# Altium schematic sheet RGBW_controller.SchDoc
size A4; DrawnBy: Sergey Starovoitov; Revision: A; SheetNumber: 1; SheetTotal: 1
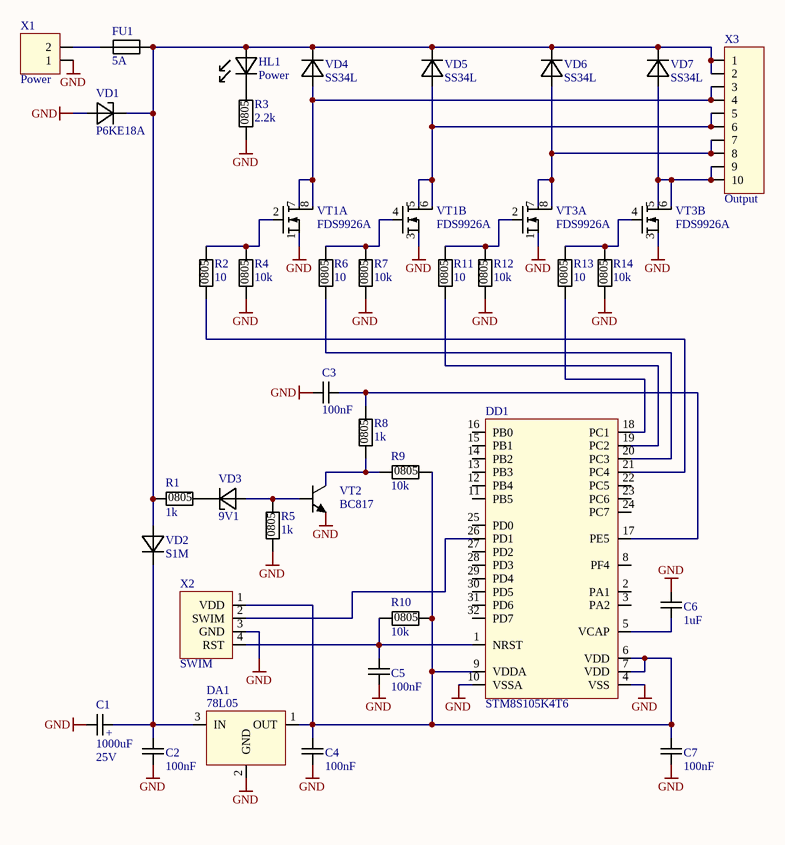
[diagram p0: RGBW_controller.SchDoc]

## Parts
C1  1000uF  Voltage: 25V  [CapEl 10x20x5 axial]
C2  100nF  [C0805]
C3  100nF  [C0805]
C4  100nF  [C0805]
C5  100nF  [C0805]
C6  1uF  [C0805]
C7  100nF  [C0805]
DA1  78L05  [TO92 line]
DD1  STM8S105K4T6  [TQFP32]
FU1  5A  [Fuse 4x10]
HL1  Power  [LED 3mm green]
R1  1k  [R0805]
R2  10  [R0805]
R3  2.2k  [R0805]
R4  10k  [R0805]
R5  1k  [R0805]
R6  10  [R0805]
R7  10k  [R0805]
R8  1k  [R0805]
R9  10k  [R0805]
R10  10k  [R0805]
R11  10  [R0805]
R12  10k  [R0805]
R13  10  [R0805]
R14  10k  [R0805]
VD1  P6KE18A  [DO15]
VD2  S1M  [SMA]
VD3  9V1  [SOD80]
VD4  SS34L  [SMA]
VD5  SS34L  [SMA]
VD6  SS34L  [SMA]
VD7  SS34L  [SMA]
VT1  FDS9926A  [SO8]  (parts A,B of 2)
VT2  BC817  [SOT23-3]
VT3  FDS9926A  [SO8]  (parts A,B of 2)
X1  Power  [DG301-5,0-2P]
X2  SWIM  [PLS4]
X3  Output  [DG380-3,81-10P]

## Nets
GND: C1.2 C2.2 C3.2 C4.2 C5.1 C6.2 C7.1 DA1.2(GND) DD1.4(VSS) DD1.10(VSSA) R3.1 R4.1 R5.1 R7.1 R12.1 R14.1 VD1.1(A) VT1.1(S) VT1.3(S) VT2.2(E) VT3.1(S) VT3.3(S) X1.1 X2.3(GND)
NetC1_1: C1.1 C2.1 DA1.3(IN) VD2.2(K)
NetC3_1: C3.1 DD1.17(PE5) R8.2
NetC4_1: C4.1 C7.2 DA1.1(OUT) DD1.6(VDD) DD1.7(VDD) DD1.9(VDDA) R9.2 R10.2 X2.1(VDD)
NetC5_2: C5.2 DD1.1(NRST) R10.1 X2.4(RST)
NetC6_1: C6.1 DD1.5(VCAP)
NetDD1_18: DD1.18(PC1) R13.1
NetDD1_19: DD1.19(PC2) R11.1
NetDD1_20: DD1.20(PC3) R6.1
NetDD1_21: DD1.21(PC4) R2.1
NetDD1_26: DD1.26(PD1) X2.2(SWIM)
NetFU1_1: FU1.1 X1.2
NetFU1_2: FU1.2 HL1.1(A) R1.1 VD1.2(K) VD2.1(A) VD4.2(K) VD5.2(K) VD6.2(K) VD7.2(K) X3.1 X3.2
NetHL1_2: HL1.2(K) R3.2
NetR1_2: R1.2 VD3.2(K)
NetR2_2: R2.2 R4.2 VT1.2(G)
NetR5_2: R5.2 VD3.1(A) VT2.1(B)
NetR6_2: R6.2 R7.2 VT1.4(G)
NetR8_1: R8.1 R9.1 VT2.3(C)
NetR11_2: R11.2 R12.2 VT3.2(G)
NetR13_2: R13.2 R14.2 VT3.4(G)
NetVD4_1: VD4.1(A) VT1.7(D1) VT1.8(D2) X3.3 X3.4
NetVD5_1: VD5.1(A) VT1.5(D1) VT1.6(D2) X3.5 X3.6
NetVD6_1: VD6.1(A) VT3.7(D1) VT3.8(D2) X3.7 X3.8
NetVD7_1: VD7.1(A) VT3.5(D1) VT3.6(D2) X3.9 X3.10

Not connected (* = marked no-connect by the designer): DD1 2(PA1) 3(PA2) 8(PF4) 11(PB5) 12(PB4) 13(PB3) 14(PB2) 15(PB1) 16(PB0) 22(PC5) 23(PC6) 24(PC7) 25(PD0) 27(PD2) 28(PD3) 29(PD4) 30(PD5) 31(PD6) 32(PD7)

## Notes on the sheet
- (in symbol CapEL_10x20x5_axial) +
- (in symbol R0805) 0805

## Library data of the parts
C1 = CapEL_10x20x5_axial: Electrolytic capacitor; Part Number: CapEL_10x20x5_axial
C2-C7 = C0805: 0805 SMD capacitors; Part Number: C0805
DA1 = L78L: Positive Linear Voltage Regulator; Part Number: L78L
DD1 = STM8S105K4T6: STM8 MCU with 16kB Flash; Part Number: STM8S105K4T6
FU1 = Fuse_4x10: PCB Leaded Fuse 4x10 15mm pitch; Part Number: Fuse_4x10
HL1 = LED 3mm green: 3mm DIP green LED; Part Number: LED 3mm green
R1-R14 = R0805: 0805 SMD 1/8W resistor; Part Number: R0805
VD1 = P6KE18A: 18V 600W THT Unidirectional Supressor; Part Number: P6KE18A
VD2 = S1M: 1A Surface Mount Rectifier; Part Number: S1M
VD3 = BZV55: 500mW SMD Zener Diode; Part Number: BZV55
VD4-VD7 = SS34L: 3A Low Case Schottky Barrier Diode; Part Number: SS34L
VT1 VT3 = FDS9926A: Dual 20V 6.5A SO8 SMD n-MOSFET transistor with Rds=30mOhm; Part Number: FDS9926A
VT2 = BC817: 45V 500mA SOT23-3 SMD NPN transistor with h21>100; Part Number: BC817
X1 = DG301-5,0-2P: 2 pin Screw Terminal PCB Block; Part Number: DG301-5,0-2P
X2 = SWIM: 4 pin SWIM connector for STM8 MCU programming; Part Number: SWIM
X3 = DG380-3,81-10P: 10 pin Screw Terminal PCB Block; Part Number: DG380-3,81-10P